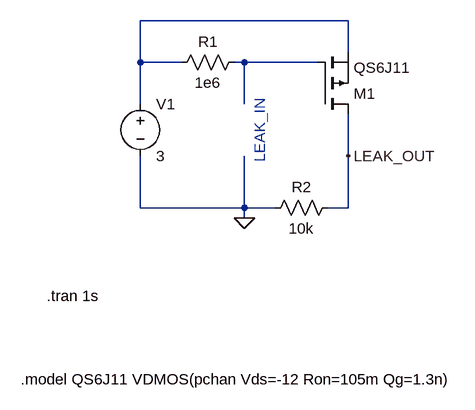
[diagram p0: schematic LTSpiceSim.asc]
LTSpiceSim.asc, the LTspice schematic file:
Version 4
SHEET 1 880 680
WIRE 512 -368 192 -368
WIRE 512 -320 512 -368
WIRE 192 -304 192 -368
WIRE 256 -304 192 -304
WIRE 352 -304 336 -304
WIRE 464 -304 352 -304
WIRE 192 -240 192 -304
WIRE 352 -240 352 -304
WIRE 512 -160 512 -224
WIRE 192 -80 192 -160
WIRE 352 -80 352 -160
WIRE 352 -80 192 -80
WIRE 400 -80 352 -80
WIRE 512 -80 512 -160
WIRE 512 -80 480 -80
WIRE 352 -64 352 -80
FLAG 352 -64 0
FLAG 512 -160 LEAK_OUT
SYMBOL pmos 464 -224 M180
SYMATTR InstName M1
SYMATTR Value QS6J11
SYMBOL res 352 -320 R90
WINDOW 0 0 56 VBottom 2
WINDOW 3 32 56 VTop 2
SYMATTR InstName R1
SYMATTR Value 1e6
SYMBOL voltage 192 -256 R0
SYMATTR InstName V1
SYMATTR Value 3
SYMBOL res 496 -96 R90
WINDOW 0 0 56 VBottom 2
WINDOW 3 32 56 VTop 2
SYMATTR InstName R2
SYMATTR Value 10k
TEXT 48 56 Left 2 !.tran 1s
TEXT 8 184 Left 2 !.model QS6J11 VDMOS(pchan Vds=-12 Ron=105m Qg=1.3n)
TEXT 376 -248 VRight 2 ;LEAK_IN

The netlist it stands for:
* LTSpiceSim.asc
M1 LEAK_OUT N002 N001 N001 QS6J11
R1 N002 N001 1e6
V1 N001 0 3
R2 LEAK_OUT 0 10k
.model NMOS NMOS
.model PMOS PMOS
.lib standard.mos
.tran 1s
.model QS6J11 VDMOS(pchan Vds=-12 Ron=105m Qg=1.3n)
* LEAK_IN
.backanno
.end